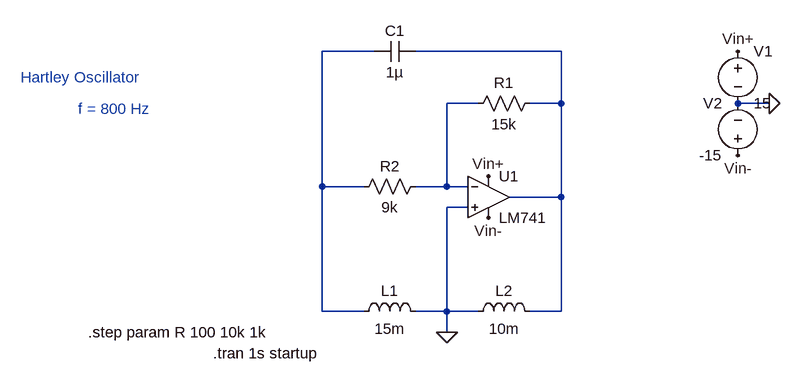
[diagram p0: schematic Hartley_Oscillator.asc]
Hartley_Oscillator.asc, the LTspice schematic file:
Version 4
SHEET 1 880 680
WIRE 80 -32 0 -32
WIRE 368 -32 144 -32
WIRE 240 48 192 48
WIRE 368 48 368 -32
WIRE 368 48 320 48
WIRE 688 48 640 48
WIRE 0 176 0 -32
WIRE 64 176 0 176
WIRE 192 176 192 48
WIRE 192 176 144 176
WIRE 224 176 192 176
WIRE 368 192 368 48
WIRE 368 192 288 192
WIRE 224 208 192 208
WIRE 0 368 0 176
WIRE 64 368 0 368
WIRE 192 368 192 208
WIRE 192 368 144 368
WIRE 240 368 192 368
WIRE 368 368 368 192
WIRE 368 368 320 368
WIRE 192 400 192 368
FLAG 688 48 0
FLAG 640 -32 Vin+
FLAG 256 160 Vin+
FLAG 640 128 Vin-
FLAG 256 224 Vin-
FLAG 192 400 0
SYMBOL OpAmps\\LM741 256 128 R0
SYMATTR InstName U1
SYMBOL voltage 640 -48 R0
SYMATTR InstName V1
SYMATTR Value 15
SYMBOL voltage 640 144 R180
WINDOW 0 24 96 Left 2
WINDOW 3 24 16 Left 2
SYMATTR InstName V2
SYMATTR Value -15
SYMBOL res 336 32 R90
WINDOW 0 0 56 VBottom 2
WINDOW 3 32 56 VTop 2
SYMATTR InstName R1
SYMATTR Value 15k
SYMBOL res 160 160 R90
WINDOW 0 0 56 VBottom 2
WINDOW 3 32 56 VTop 2
SYMATTR InstName R2
SYMATTR Value 9k
SYMBOL cap 144 -48 R90
WINDOW 0 0 32 VBottom 2
WINDOW 3 32 32 VTop 2
SYMATTR InstName C1
SYMATTR Value 1µ
SYMBOL ind 48 384 R270
WINDOW 0 32 56 VTop 2
WINDOW 3 5 56 VBottom 2
SYMATTR InstName L1
SYMATTR Value 15m
SYMBOL ind 224 384 R270
WINDOW 0 32 56 VTop 2
WINDOW 3 5 56 VBottom 2
SYMATTR InstName L2
SYMATTR Value 10m
TEXT -168 432 Left 2 !.tran 1s startup
TEXT -360 400 Left 2 !.step param R 100 10k 1k
TEXT -464 8 Left 2 ;Hartley Oscillator
TEXT -376 56 Left 2 ;f = 800 Hz

The netlist it stands for:
* Hartley_Oscillator.asc
XU1 0 N003 Vin+ Vin- N002 LM741  ; pins In+ In- V+ V- OUT
V1 Vin+ 0 15
V2 Vin- 0 -15
R1 N002 N003 15k
R2 N003 N001 9k
C1 N002 N001 1µ
L1 N001 0 15m
L2 0 N002 10m
.tran 1s startup
.step param R 100 10k 1k
* Hartley Oscillator
* f = 800 Hz
.lib LM741.lib
.backanno
.end